# EAGLE design picoAvaR4 (EAGLE 6.1)
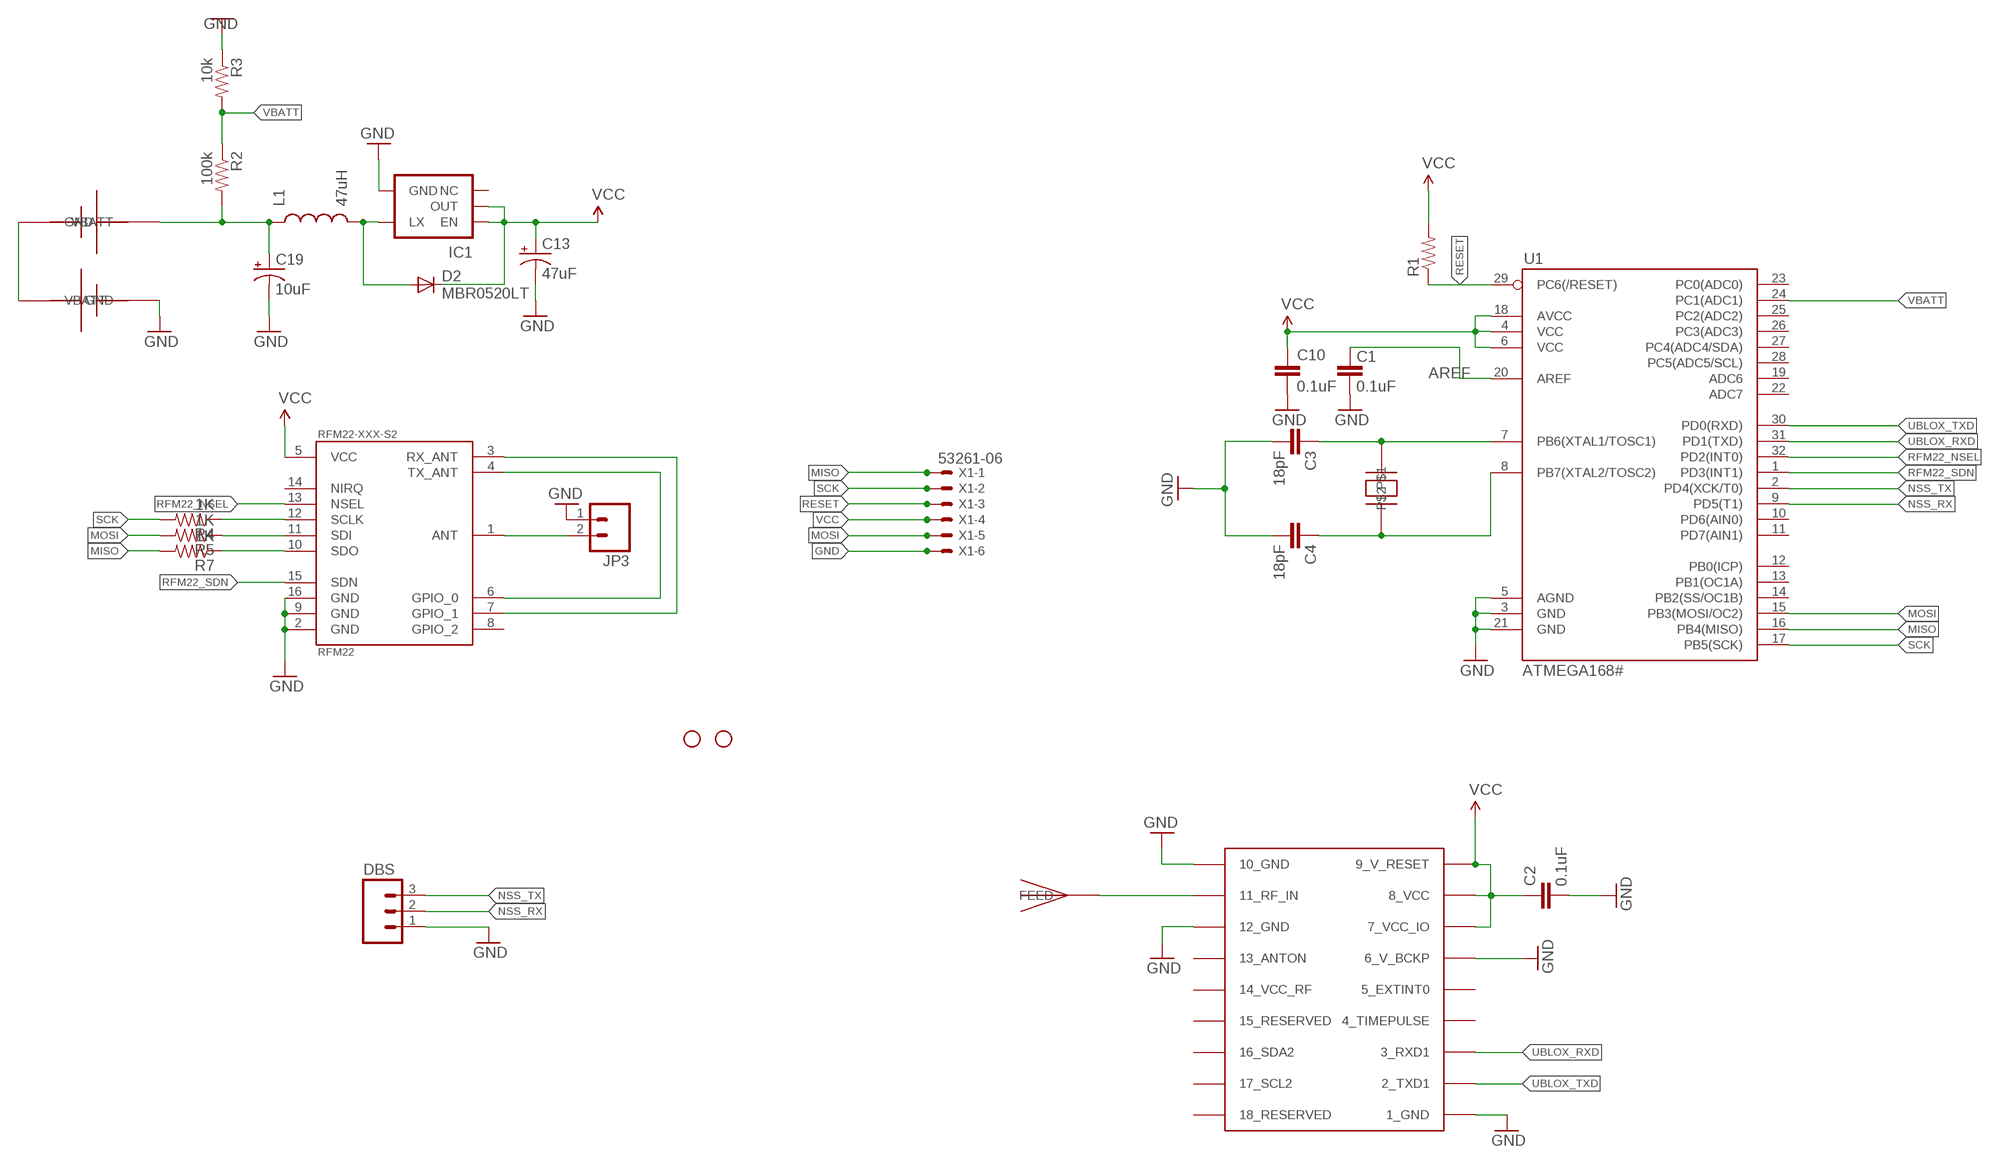
[diagram p0: schematic, sheet 1]

## Parts
C1  0.1uF  CAP0402-CAP  [0402-CAP]
C2  0.1uF  CAP0402-CAP  [0402-CAP]
C3  18pF  CAP0402-CAP  [0402-CAP]
C4  18pF  CAP0402-CAP  [0402-CAP]
C10  0.1uF  CAP0402-CAP  [0402-CAP]
C13  47uF  CAP_POL1206  [EIA3216]
C19  10uF  CAP_POL1206  [EIA3216]
D2  MBR0520LT  [SOD123]
DBS  M03PTH  [1X03]
IC1  V_REG_NCP1400SOT23-5  [SOT23-5]
JP1  STAND-OFF  [STAND-OFF]
JP2  STAND-OFF  [STAND-OFF]
JP3  M02PTH  [1X02]
L1  47uH  INDUCTOR1210  [1210]
R1  RESISTOR0402-RES  [0402-RES]
R2  100k  RESISTOR0402-RES  [0402-RES]
R3  10k  RESISTOR0402-RES  [0402-RES]
R4  1K  RESISTOR0402-RES  [0402-RES]
R5  1K  RESISTOR0402-RES  [0402-RES]
R7  1K  RESISTOR0402-RES  [0402-RES]
RFM22-XXX-S2  RFM22  [RFM22-XXX-S2]
U1  ATMEGA168#  ATMEGA168  [TQFP32-08]
U$1  UBLOX_MAX-6  [UBLOX_MAX-6]
U$2  ABRACON_ABM3_CRYSTAL  [ABRACON_ABM3_CRYSTAL]
U$3  JTI_ANTENNA-1575AT43A40  [JTI_ANTENNA-1575AT43A40]
U$4  KEYSTONE-82-AAA-BATTERY-HOLDER  [KEYSTONE-82-AAA-BATTERY]
U$5  KEYSTONE-82-AAA-BATTERY-HOLDER  [KEYSTONE-82-AAA-BATTERY]
X1  53261-06  [53261-06]

## Nets
AREF: C1.2 U1.20(AREF)
BATTERY [vcc]: C19.A(+) L1.1 R2.2 U$4.VBATT U$4.VBATT1(VBATT)
GND [vcc]: C1.1 C2.2 C3.2 C4.2 C10.2 C13.C(-) C19.C(-) DBS.1 IC1.4(GND) JP3.1 R3.1 RFM22-XXX-S2.2(GND) RFM22-XXX-S2.9(GND) RFM22-XXX-S2.16(GND) U1.3(GND) U1.5(AGND) U1.21(GND) U$1.1_GND U$1.6_V_BCKP U$1.10_GND U$1.12_GND U$5.GND U$5.GND2(GND) X1.6
MISO: R7.2 U1.16(PB4(MISO)) X1.1
MOSI: R5.2 U1.15(PB3(MOSI/OC2)) X1.5
N$1: U$4.GND U$4.GND2(GND) U$5.VBATT U$5.VBATT1(VBATT)
N$2: R4.1 RFM22-XXX-S2.12(SCLK)
N$3: JP3.2 RFM22-XXX-S2.1(ANT)
N$4: U$1.11_RF_IN U$3.FEED
N$5: RFM22-XXX-S2.3(RX_ANT) RFM22-XXX-S2.7(GPIO_1)
N$6: RFM22-XXX-S2.4(TX_ANT) RFM22-XXX-S2.6(GPIO_0)
N$7: R5.1 RFM22-XXX-S2.11(SDI)
N$9: C3.1 U1.7(PB6(XTAL1/TOSC1)) U$2.P$2
N$10: C4.1 U1.8(PB7(XTAL2/TOSC2)) U$2.P$1
N$11: D2.A IC1.5(LX) L1.2
N$12: R7.1 RFM22-XXX-S2.10(SDO)
NSS_RX: DBS.2 U1.9(PD5(T1))
NSS_TX: DBS.3 U1.2(PD4(XCK/T0))
RESET: R1.1 U1.29(PC6(/RESET)) X1.3
RFM22_NSEL: RFM22-XXX-S2.13(NSEL) U1.32(PD2(INT0))
RFM22_SDN: RFM22-XXX-S2.15(SDN) U1.1(PD3(INT1))
SCK: R4.2 U1.17(PB5(SCK)) X1.2
UBLOX_RXD: U1.31(PD1(TXD)) U$1.3_RXD1
UBLOX_TXD: U1.30(PD0(RXD)) U$1.2_TXD1
VBATT [vcc]: R2.1 R3.2 U1.24(PC1(ADC1))
VCC: C2.1 C10.1 C13.A(+) D2.C IC1.1(EN) IC1.2(OUT) R1.2 RFM22-XXX-S2.5(VCC) U1.4(VCC) U1.6(VCC) U1.18(AVCC) U$1.7_VCC_IO U$1.8_VCC U$1.9_V_RESET X1.4
Unconnected: IC1.3(NC) RFM22-XXX-S2.8(GPIO_2) RFM22-XXX-S2.14(NIRQ) U1.10(PD6(AIN0)) U1.11(PD7(AIN1)) U1.12(PB0(ICP)) U1.13(PB1(OC1A)) U1.14(PB2(SS/OC1B)) U1.19(ADC6) U1.22(ADC7) U1.23(PC0(ADC0)) U1.25(PC2(ADC2)) U1.26(PC3(ADC3)) U1.27(PC4(ADC4/SDA)) U1.28(PC5(ADC5/SCL)) U$1.4_TIMEPULSE U$1.5_EXTINT0 U$1.13_ANTON U$1.14_VCC_RF U$1.15_RESERVED U$1.16_SDA2 U$1.17_SCL2 U$1.18_RESERVED

## Library data of the parts
C1-C4 C10 = SparkFun:CAP: Capacitor Standard 0603 ceramic capacitor, and 0.1" leaded capacitor.
C13 C19 = SparkFun:CAP_POL: Capacitor Polarized These are standard SMD and PTH capacitors. Normally 10uF, 47uF, and 100uF in electrolytic and tantalum varieties. Always verify the external diameter of the through hole cap, it varies with capacity, voltage, and manufacturer. The EIA devices should be standard.
D2 = diode:MBR0520LT: SCHOTTKY BARRIER RECTIFIER Source: http://onsemi.com .. MBR0520LT1-D.pdf
DBS = SparkFun:M03: Header 3 Standard 3-pin 0.1" header. Use with straight break away headers (SKU : PRT-00116), right angle break away headers (PRT-00553), swiss pins (PRT-00743), machine pins (PRT-00117), and female headers (PRT-00115). Molex polarized connector foot print use with SKU : PRT-08232 with associated crimp pins and housings.
IC1 = SparkFun:V_REG_NCP1400: Switching step-up voltage regulator NCP1400 switiching regulator takes single cell AA and outputs 100mA at 3.3V or 5V with minimal number of external components.
JP1 JP2 = SparkFun:STAND-OFF: Stand Off This is the mechanical footprint for a #4 phillips button head screw. Use the keepout ring to avoid running the screw head into surrounding components. SKU : PRT-00447
JP3 = SparkFun:M02: Header 2 Standard 2-pin 0.1" header. Use with straight break away headers (SKU : PRT-00116), right angle break away headers (PRT-00553), swiss pins (PRT-00743), machine pins (PRT-00117), and female headers (PRT-00115). Molex polarized connector foot print use with SKU : PRT-08233 with associated crimp pins and housings.
L1 = SparkFun:INDUCTOR: Inductors Basic Inductor/Choke - 0603 and 1206. Footprints are not proven and vary greatly between part numbers.
R1-R5 R7 = SparkFun:RESISTOR: Resistor Basic schematic elements and footprints for 0603, 1206, and PTH resistors.
RFM22-XXX-S2 = SparkFun:RFM22: *Hope RF's RFM22* Packages: RFM22-S2 (SMD)
U1 = SparkFun:ATMEGA168
U$1 = ava:UBLOX_MAX-6: UBLOX MAX-6
U$2 = ava:ABRACON_ABM3_CRYSTAL
U$3 = ava:JTI_ANTENNA-1575AT43A40
U$4 U$5 = ava:KEYSTONE-82-AAA-BATTERY-HOLDER
X1 = con-molex:53?-06: CONNECTOR wire to board 1.25 mm (.049 inch) pitch header; OC_FARNELL: 1125375; OC_NEWARK: unknown

## Net classes
0 default: width 0.203 mm
1 vcc: width 0.254 mm

## Board
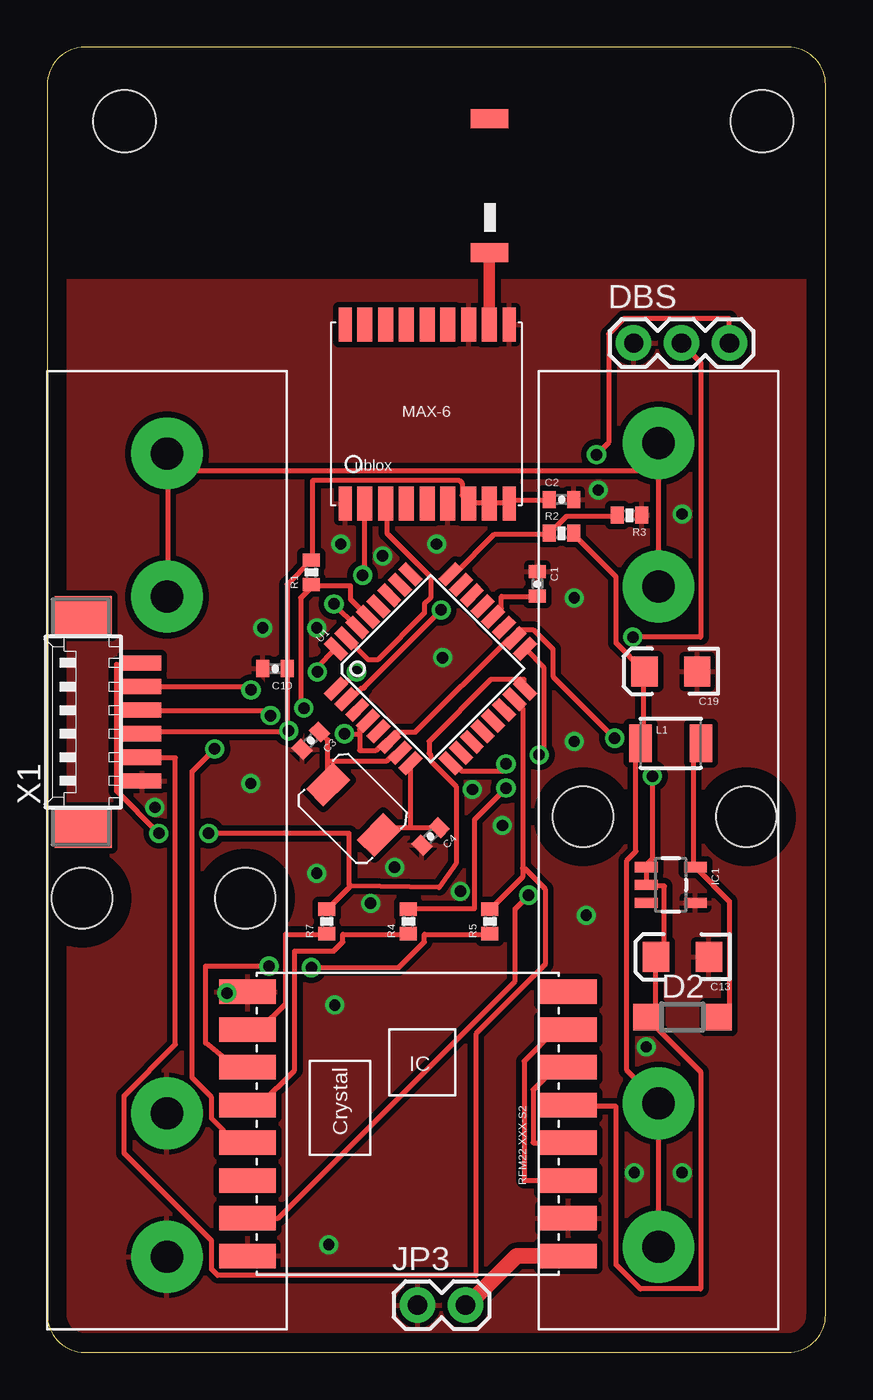
[diagram p1: board, top side]
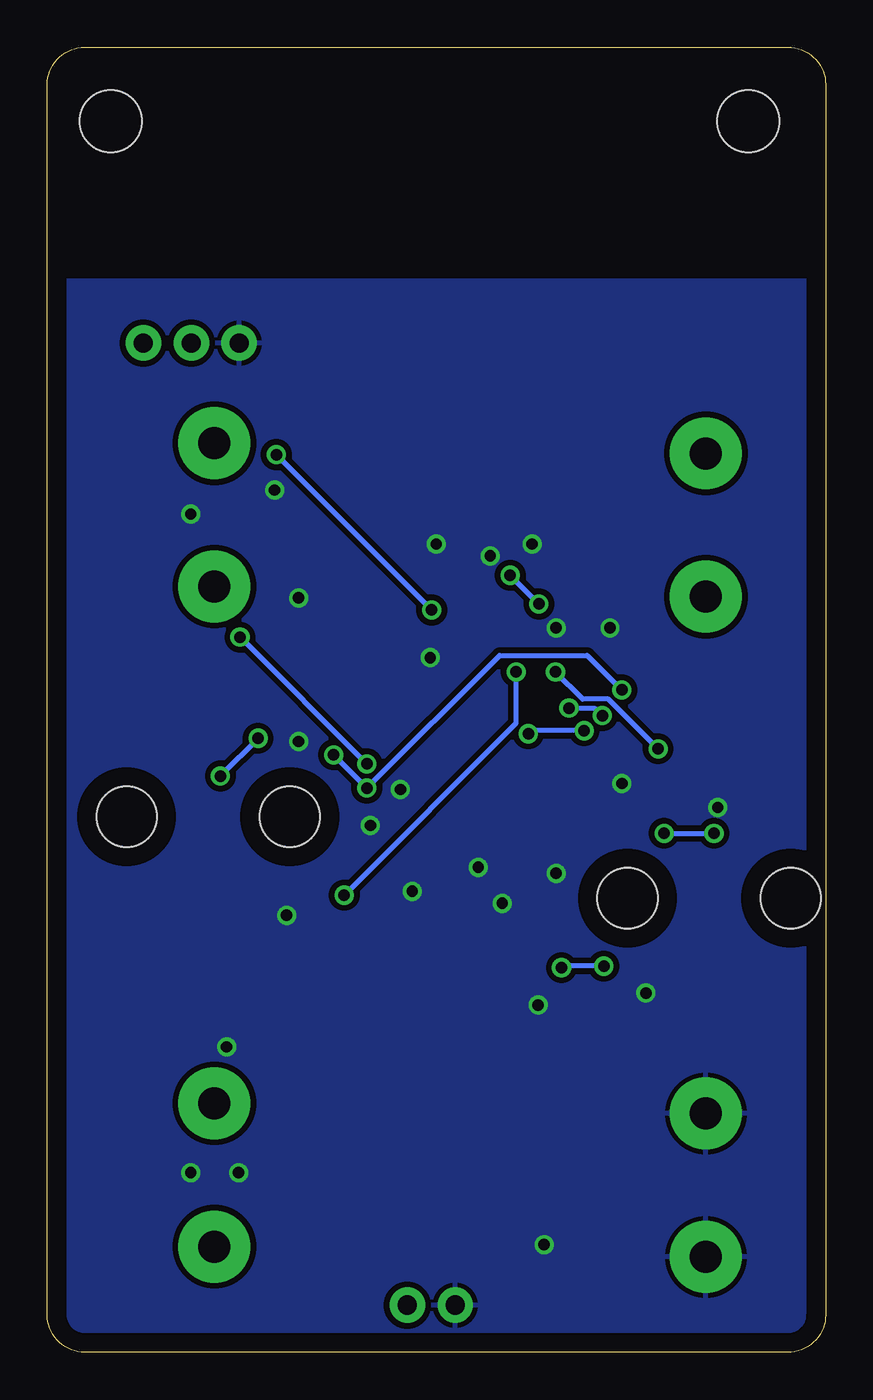
[diagram p2: board, bottom side, seen from below]

Size 41.26 x 69.2 mm. Coordinates in mm from the lower left corner, seen from the top.
Outline: 41.26,2 41.26,67.2 arc90 39.26,69.2 2,69.2 arc90 0,67.2 0,2 arc90 2,0 39.26,0 arc90 41.26,2
Copper layers (1*16): Top 0.035mm / dielectric 1.5mm / Bottom 0.035mm
Design rules: minimum track width 10mil, minimum drill 24mil, track to track 8mil, track to pad 8mil, pad to pad 8mil, via to via 8mil, smd to smd 8mil, copper to edge 40mil, drill to drill 8mil, minimum pad ring 10mil, minimum via ring 8mil, stop-mask expansion 4mil, vias tented up to drill 0mil, thermal gap 10mil
Holes 3.2 mm at 10.5,24.08 28.4,28.4 37.05,28.4 1.85,24.08

### Footprints (pad centres in the part's own frame; a part is rotated, then mirrored left to right if it is on the bottom)
0402-CAP = smd 0.7 x 0.9: 1 -0.65,0; 2 0.65,0
EIA3216 = smd 1.4 x 1.6: A 1.4,0; C -1.4,0
SOD123 = smd 1.4 x 1.4: A 1.9,0; C -1.9,0
1X03 = drill 1.016 pad 1.88: 1 0,0; 2 2.54,0; 3 5.08,0
SOT23-5 = smd 0.55 x 1.2: 1 -0.95,-1.3; 2 0,-1.3; 3 0.95,-1.3; 4 0.95,1.3; 5 -0.95,1.3
STAND-OFF = hole 3.302: 0,0
1X02 = drill 1.016 pad 1.88: 1 0,0; 2 2.54,0
1210 = smd 1.2 x 2: 1 -1.6,0; 2 1.6,0
0402-RES = smd 0.7 x 0.9: 1 -0.65,0; 2 0.65,0
RFM22-XXX-S2 = smd 3 x 1.3: 1 -8.5,7; 2 -8.5,5; 3 -8.5,3; 4 -8.5,1; 5 -8.5,-1; 6 -8.5,-3; 7 -8.5,-5; 8 -8.5,-7; 9 8.5,-7; 10 8.5,-5; 11 8.5,-3; 12 8.5,-1; 13 8.5,1; 14 8.5,3; 15 8.5,5; 16 8.5,7
TQFP32-08 = smd 1.27 x 0.559: 1 -4.293,2.8; 2 -4.293,2; 3 -4.293,1.2; 4 -4.293,0.4; 5 -4.293,-0.4; 6 -4.293,-1.2; 7 -4.293,-2; 8 -4.293,-2.8; 17 4.293,-2.8; 18 4.293,-2; 19 4.293,-1.2; 20 4.293,-0.4; 21 4.293,0.4; 22 4.293,1.2; 23 4.293,2; 24 4.293,2.8 | smd 0.559 x 1.27: 9 -2.8,-4.293; 10 -2,-4.293; 11 -1.2,-4.293; 12 -0.4,-4.293; 13 0.4,-4.293; 14 1.2,-4.293; 15 2,-4.293; 16 2.8,-4.293; 25 2.8,4.293; 26 2,4.293; 27 1.2,4.293; 28 0.4,4.293; 29 -0.4,4.293; 30 -1.2,4.293; 31 -2,4.293; 32 -2.8,4.293
UBLOX_MAX-6 = smd 1.8 x 0.7: 1_GND 4.95,-4.4; 9_V_RESET 4.95,4.3; 10_GND -4.55,4.3; 18_RESERVED -4.55,-4.4 | smd 1.8 x 0.8: 2_TXD1 4.95,-3.35; 3_RXD1 4.95,-2.25; 4_TIMEPULSE 4.95,-1.15; 5_EXTINT0 4.95,-0.05; 6_V_BCKP 4.95,1.05; 7_VCC_IO 4.95,2.15; 8_VCC 4.95,3.25; 11_RF_IN -4.55,3.25; 12_GND -4.55,2.15; 13_ANTON -4.55,1.05; 14_VCC_RF -4.55,-0.05; 15_RESERVED -4.55,-1.15; 16_SDA2 -4.55,-2.25; 17_SCL2 -4.55,-3.35
ABRACON_ABM3_CRYSTAL = smd 1.3 x 2: P$1 -3.4,0.1; P$2 0.4,0.1
JTI_ANTENNA-1575AT43A40 = smd 1 x 2: FEED -3.81,-1.27; NC 3.29,-1.27
KEYSTONE-82-AAA-BATTERY = drill 1.7 pad 3.81: GND -21.57,0; GND2 -13.97,0; VBATT 13.43,0; VBATT1 21.03,0
53261-06 = smd 0.8 x 2: 1 3.125,-2.5; 2 1.875,-2.5; 3 0.625,-2.5; 4 -0.625,-2.5; 5 -1.875,-2.5; 6 -3.125,-2.5 | smd 2.1 x 3: S1 5.625,0.625; S2 -5.625,0.625

### Placement (x,y rotation side)
C1  25.98,40.74 270 top
C2  27.27,45.22 0 top
C3  13.97,32.44 225 top
C4  20.32,27.36 225 top
C10  12.08,36.25 180 top
C13  33.67,20.97 180 top
C19  33.06,36.11 180 top
D2  33.67,17.78 0 top
DBS  31.08,53.52 0 top
IC1  33.06,24.78 270 top
JP1  4.1,65.28 0 top
JP2  37.89,65.28 0 top
JP3  19.63,2.5 0 top
L1  33.06,32.3 0 top
R1  14.01,41.36 90 top
R2  27.26,43.44 0 top
R3  30.86,44.39 180 top
R4  19.14,22.85 90 top
R5  23.46,22.85 90 top
R7  14.82,22.85 90 top
RFM22-XXX-S2  19.12,12.12 180 top
U1  20.32,36.25 45 top
U$1  20.19,49.95 270 top
U$2  15.24,29.9 135 top
U$3  22.17,62.12 90 top
U$4  32.4,26.64 270 top
U$5  6.35,26.64 90 top
X1  2.54,33.43 90 top

### Tracks (layer width: path | path; a pad name or v marks a point on that pad's centre or on a via)
AREF
  Top 0.254: C1.2 25.92,40.08 24.08,40.08 24.08,39.44 23.68,39.04 U1.20
BATTERY
  Top 0.254: R2.2 27.92,43.36 30.16,41.12 30.16,37.6 31.6,36.16 C19.A 31.6,36 31.6,32.4 31.52,32.32 L1.1 31.36,32.24 31.2,32.08 31.2,26.56 30.72,26.08 30.72,14.96 32.4,13.28 U$4.VBATT 32.4,13.12 32.4,5.68 U$4.VBATT1
GND  (via drill 0.6)
  other vias: 15.56,42.86 20.64,42.86 20.95,36.83 17.78,42.23 14.29,38.42 27.94,40.01 29.21,45.72 11.43,38.42 10.79,30.16 5.71,28.89 14.29,25.4 17.14,23.81 15.24,18.41 28.57,23.18 24.13,27.94 18.41,25.72 21.91,24.45 22.54,29.84 27.94,32.38 14.92,5.71 9.53,19.05 31.11,9.53 33.66,9.53 31.75,16.19 33.66,44.45
  pour Top (isolate 0.305): 0,56.81 40.75,56.81 40.75,0 2,0 arc-90 0,2
  pour Bottom (isolate 0.305): 0,56.81 40.75,56.81 40.75,0 2,0 arc-90 0,2
MISO  (via drill 0.61)
  Top 0.254: 16.08,24.72 20.77,24.65 21.68,25.92 21.68,30 20.32,31.36 20.32,31.68 20.24,31.76 20.24,32.4 23.52,35.68 25.28,35.68 25.28,35.2 U1.16 | 16.08,24.72 14.88,23.52 R7.2 | v5.92,27.52 3.68,29.76 3.68,36.48 5.04,36.48 X1.1 | v8.56,27.52 16,27.52 16,24.8 16.08,24.72
  Bottom 0.254: v8.56,27.52 v5.92,27.52
MOSI
  Top 0.254: 25.2,25.68 25.2,34.16 24.8,34.56 U1.15 | 25.2,25.68 25.2,25.2 23.52,23.52 R5.2 | X1.5 5.04,31.52 6.8,31.52 6.8,16.32 4.08,13.6 4.08,10.56 8.72,5.92 8.72,4.4 9.04,4.08 22.72,4.08 22.72,16.88 26.4,20.56 26.4,24.56 25.28,25.68 25.2,25.68
N$1
  Top 0.254: U$5.VBATT 6.4,40.08 6.4,47.6 U$5.VBATT1 6.48,46.72 32.32,46.72 U$4.GND 32.4,48.16 32.4,40.64 U$4.GND2
N$2
  Top 0.254: R4.1 19.12,22.16 15.68,22.16 15.68,21.76 15.2,21.28 13.12,21.28 13.12,14.96 11.28,13.12 10.64,13.12 RFM22-XXX-S2.12
N$3
  Top 0.254: JP3.2 22.16,2.48 22.23,2.47
  Top 0.406: RFM22-XXX-S2.1 27.79,5.12
  Top 0.813: RFM22-XXX-S2.1 24.88,5.12 22.23,2.47
N$4
  Top 0.61: U$3.FEED U$1.11_RF_IN
N$5
  Top 0.254: RFM22-XXX-S2.3 27.6,9.12 25.28,9.12 25.28,15.44 26.88,17.04 27.6,17.04 RFM22-XXX-S2.7
N$6
  Top 0.254: RFM22-XXX-S2.4 27.6,11.12 25.76,11.12 25.76,13.92 26.88,15.04 27.6,15.04 RFM22-XXX-S2.6
N$7  (via drill 0.61)
  Top 0.254: v14,20.4 18.64,20.4 20,21.76 20,22.16 23.44,22.16 R5.1 | v11.76,20.48 8.4,20.48 8.4,16.4 10,15.12 10.56,15.12 RFM22-XXX-S2.11
  Bottom 0.254: v14,20.4 13.92,20.48 v11.76,20.48
N$9
  Top 0.254: 14.88,31.36 14.88,30.16 U$2.P$2 | 14.88,31.36 14.88,32.48 14.48,32.88 C3.1 | 14.88,31.36 18,31.36 18.4,31.76 18.64,31.76 U1.7
N$10
  Top 0.254: 19.28,27.84 17.6,27.84 17.6,27.44 U$2.P$1 | 19.28,27.84 20.72,27.84 C4.1 | 19.28,27.84 19.28,31.2 U1.8
N$11
  Top 0.254: L1.2 34.64,32.24 34.24,31.84 34.24,25.84 34.32,25.76 IC1.5 34.4,25.68 36.16,23.92 36.16,18.4 35.6,17.84 D2.A
N$12
  Top 0.254: R7.1 14.8,22.16 12.64,22.16 12.64,18.48 11.28,17.12 10.64,17.12 RFM22-XXX-S2.10
NSS_RX  (via drill 0.61)
  Top 0.254: v24.32,31.2 24.32,30.8 22,30.8 21.6,31.2 21.44,31.2 U1.9 | v31.04,37.92 34.64,37.92 34.64,52.48 33.68,53.44 DBS.2
  Bottom 0.254: v31.04,37.92 v24.32,31.2
NSS_TX  (via drill 0.61)
  Top 0.254: v20.88,39.36 16.8,35.28 16.8,35.2 16.64,35.2 16.08,34.64 15.92,34.64 U1.2 | v29.12,47.6 29.76,48.24 29.76,54 30.56,54.8 36.16,54.8 DBS.3
  Bottom 0.254: v29.12,47.6 v20.88,39.36
RESET  (via drill 0.61)
  Top 0.254: U1.29 16.96,39.04 16.08,39.92 16.08,40.64 14.08,40.64 R1.1 14,40.56 13.44,40 13.44,34.32 v13.6,34.16 | v11.84,33.76 11.84,34 5.04,34 X1.3
  Bottom 0.254: v11.84,33.76 12.24,34.16 v13.6,34.16
RFM22_NSEL  (via drill 0.61)
  Top 0.254: v14.32,36.08 14.32,36.32 15.28,37.28 U1.32 | v8.88,32 7.68,30.8 7.68,14.56 8.72,13.52 8.72,12.4 10,11.12 10.56,11.12 RFM22-XXX-S2.13
  Bottom 0.254: v14.32,36.08 12.88,34.64 11.52,34.64 v8.88,32
RFM22_SDN  (via drill 0.61)
  Top 0.254: v16.4,36.08 15.52,35.2 15.36,35.2 U1.1 | v25.52,24.24 24.8,23.52 24.8,19.68 12.24,7.12 10.64,7.12 RFM22-XXX-S2.15
  Bottom 0.254: v16.4,36.08 16.4,33.36 v25.52,24.24
SCK  (via drill 0.61)
  Top 0.254: v24.32,29.92 22.64,28.24 22.64,23.52 19.2,23.52 R4.2 | v26.08,31.68 26.32,31.92 26.32,36.32 25.36,37.28 U1.17 | v10.8,35.12 10.8,35.28 5.04,35.28 X1.2
  Bottom 0.254: v26.08,31.68 v24.32,29.92 17.28,36.96 12.64,36.96 v10.8,35.12
UBLOX_RXD
  Top 0.254: U1.31 15.92,37.84 17.04,36.72 17.52,36.72 20,39.2 20,39.68 20.32,40 20.32,41.12 18,43.44 18,44.96 U$1.3_RXD1
UBLOX_TXD  (via drill 0.61)
  Top 0.254: v15.2,39.68 16.4,38.48 U1.30 | v16.72,41.2 16.8,41.28 16.8,44.96 U$1.2_TXD1
  Bottom 0.254: v16.72,41.2 v15.2,39.68
VBATT
  Top 0.254: R3.2 30.16,44.32 27.52,44.32 26.64,43.44 R2.1 26.56,43.36 23.68,43.36 21.6,41.28 21.44,41.28 U1.24
VCC  (via drill 0.61)
  Top 0.254: RFM22-XXX-S2.5 27.68,13.04 30.16,13.04 30.16,4.64 31.44,3.36 34.64,3.36 34.64,14.88 31.84,17.68 D2.C 31.84,17.84 32.24,18.24 32.24,20.96 C13.A 32.32,21.04 32.72,21.44 32.72,24.72 31.84,24.72 IC1.2 31.76,24.8 31.76,25.68 IC1.1 31.76,25.84 32.08,26.16 v32.08,30.56 | 16.56,32.8 16.56,33.04 16.96,33.44 U1.4 | 16.56,32.8 16.56,31.92 17.44,31.92 17.84,32.32 18.08,32.32 U1.6 18.16,32.48 18.16,32.56 18.48,32.88 19.52,32.88 24.48,37.84 24.72,37.84 U1.18 24.88,37.92 24.96,38 24.96,38.32 25.76,38.32 26.8,37.28 26.8,35.84 v30.08,32.56 | C2.1 26.56,45.2 24.56,45.2 24.56,45.04 U$1.9_V_RESET 24.4,45.04 23.52,45.04 U$1.8_VCC 23.44,45.04 22.4,45.04 U$1.7_VCC_IO 22.32,45.12 22,45.44 22,46.08 21.84,46.24 14.08,46.24 14.08,42.08 R1.2 12.72,40.72 12.72,36.32 C10.1 12.72,36.16 12.72,32.88 | 12.72,32.88 5.04,32.88 X1.4 | v15.76,32.8 16.56,32.8 | v12.8,32.96 12.72,32.88
  Bottom 0.254: v15.76,32.8 15.6,32.96 v12.8,32.96 | v30.08,32.56 v32.08,30.56